# EAGLE design untitled (EAGLE 9.6.0)
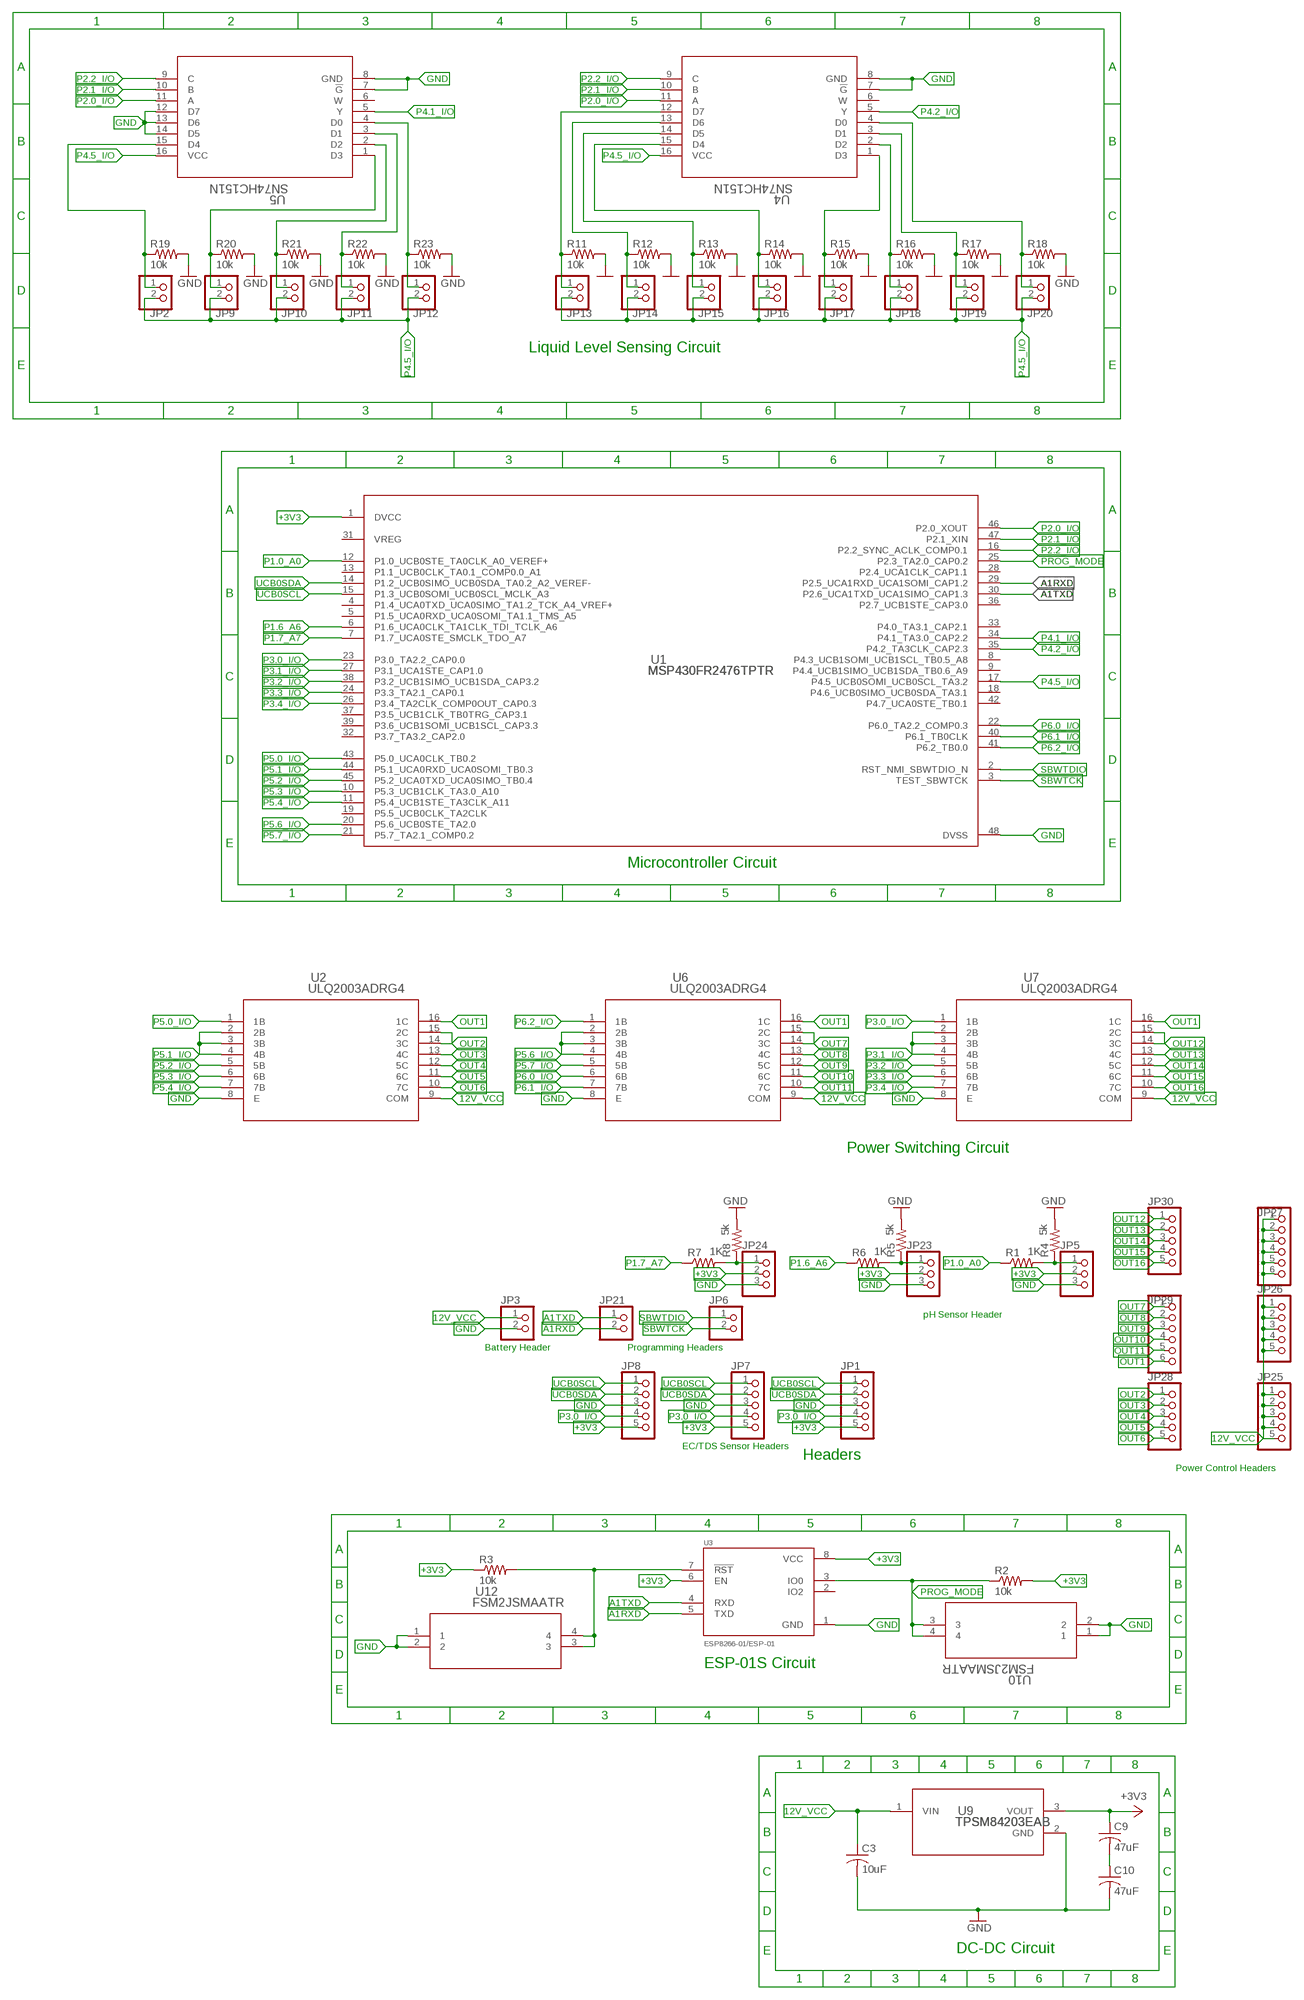
[diagram p0: schematic, sheet 1]

## Parts
C3  10uF  C-USC1206  [C1206]
C9  47uF  C-USC1206  [C1206]
C10  47uF  C-USC1206  [C1206]
JP1  PINHD-1X5  [1X05]
JP2  PINHD-1X2  [1X02]
JP3  PINHD-1X2  [1X02]
JP5  PINHD-1X3  [1X03]
JP6  PINHD-1X2  [1X02]
JP7  PINHD-1X5  [1X05]
JP8  PINHD-1X5  [1X05]
JP9  PINHD-1X2  [1X02]
JP10  PINHD-1X2  [1X02]
JP11  PINHD-1X2  [1X02]
JP12  PINHD-1X2  [1X02]
JP13  PINHD-1X2  [1X02]
JP14  PINHD-1X2  [1X02]
JP15  PINHD-1X2  [1X02]
JP16  PINHD-1X2  [1X02]
JP17  PINHD-1X2  [1X02]
JP18  PINHD-1X2  [1X02]
JP19  PINHD-1X2  [1X02]
JP20  PINHD-1X2  [1X02]
JP21  PINHD-1X2  [1X02]
JP23  PINHD-1X3  [1X03]
JP24  PINHD-1X3  [1X03]
JP25  PINHD-1X5  [1X05]
JP26  PINHD-1X5  [1X05]
JP27  PINHD-1X6  [1X06]
JP28  PINHD-1X5  [1X05]
JP29  PINHD-1X6  [1X06]
JP30  PINHD-1X5  [1X05]
R1  1K  R-US_R1206  [R1206]
R2  10k  R-US_R1206  [R1206]
R3  10k  R-US_R1206  [R1206]
R4  5k  R-US_R1206  [R1206]
R5  5k  R-US_R1206  [R1206]
R6  1K  R-US_R1206  [R1206]
R7  1K  R-US_R1206  [R1206]
R8  5k  R-US_R1206  [R1206]
R11  10k  R-US_R1206  [R1206]
R12  10k  R-US_R1206  [R1206]
R13  10k  R-US_R1206  [R1206]
R14  10k  R-US_R1206  [R1206]
R15  10k  R-US_R1206  [R1206]
R16  10k  R-US_R1206  [R1206]
R17  10k  R-US_R1206  [R1206]
R18  10k  R-US_R1206  [R1206]
R19  10k  R-US_R1206  [R1206]
R20  10k  R-US_R1206  [R1206]
R21  10k  R-US_R1206  [R1206]
R22  10k  R-US_R1206  [R1206]
R23  10k  R-US_R1206  [R1206]
U1  MSP430FR2476TPTR  [PT0048A_N]
U2  ULQ2003ADRG4  [D16]
U3  ESP8266-01/ESP-01  [XCVR_ESP8266-01/ESP-01]
U4  SN74HC151N  [N16]
U5  SN74HC151N  [N16]
U6  ULQ2003ADRG4  [D16]
U7  ULQ2003ADRG4  [D16]
U9  TPSM84203EAB  [EAB0003A]
U10  FSM2JSMAATR  [SWITCH_FSM2JSMAA_TYC]
U12  FSM2JSMAATR  [SWITCH_FSM2JSMAA_TYC]

## Nets
12V_VCC: C3.1 JP3.1 JP25.1 JP25.2 JP25.3 JP25.4 JP25.5 JP26.1 JP26.2 JP26.3 JP26.4 JP26.5 JP27.1 JP27.2 JP27.3 JP27.4 JP27.5 JP27.6 U2.9(COM) U6.9(COM) U7.9(COM) U9.1(VIN)
+3V3: C9.1 JP1.5 JP5.2 JP7.5 JP8.5 JP23.2 JP24.2 R2.2 R3.1 U1.1(DVCC) U3.6(EN) U3.8(VCC) U9.3(VOUT)
A1RXD: JP21.2 U1.29(P2.5_UCA1RXD_UCA1SOMI_CAP1.2) U3.5(TXD)
A1TXD: JP21.1 U1.30(P2.6_UCA1TXD_UCA1SIMO_CAP1.3) U3.4(RXD)
GND: C3.2 C10.2 JP1.3 JP3.2 JP5.3 JP7.3 JP8.3 JP23.3 JP24.3 R4.2 R5.2 R8.2 R11.2 R12.2 R13.2 R14.2 R15.2 R16.2 R17.2 R18.2 R19.2 R20.2 R21.2 R22.2 R23.2 U1.48(DVSS) U2.8(E) U3.1(GND) U4.7(!G) U4.8(GND) U5.7(!G) U5.8(GND) U5.12(D7) U5.13(D6) U5.14(D5) U6.8(E) U7.8(E) U9.2(GND) U10.1 U10.2 U12.1 U12.2
N$1: R3.2 U3.7(!RST) U12.3 U12.4
N$2: JP18.1 R16.1 U4.2(D2)
N$3: JP19.1 R17.1 U4.3(D1)
N$4: JP13.1 R11.1 U4.12(D7)
N$5: C9.2 C10.1
N$6: JP14.1 R12.1 U4.13(D6)
N$7: JP15.1 R13.1 U4.14(D5)
N$8: JP16.1 R14.1 U4.15(D4)
N$9: JP5.1 R1.2 R4.1
N$10: JP23.1 R5.1 R6.2
N$11: JP24.1 R7.2 R8.1
N$13: JP20.1 R18.1 U4.4(D0)
N$14: JP2.1 R19.1 U5.15(D4)
N$15: JP12.1 R23.1 U5.4(D0)
N$16: JP9.1 R20.1 U5.1(D3)
N$17: JP10.1 R21.1 U5.2(D2)
N$18: JP11.1 R22.1 U5.3(D1)
N$63: JP17.1 R15.1 U4.1(D3)
OUT1: JP29.6 U2.16(1C) U6.16(1C) U7.16(1C)
OUT2: JP28.1 U2.14(3C) U2.15(2C)
OUT3: JP28.2 U2.13(4C)
OUT4: JP28.3 U2.12(5C)
OUT5: JP28.4 U2.11(6C)
OUT6: JP28.5 U2.10(7C)
OUT7: JP29.1 U6.14(3C) U6.15(2C)
OUT8: JP29.2 U6.13(4C)
OUT9: JP29.3 U6.12(5C)
OUT10: JP29.4 U6.11(6C)
OUT11: JP29.5 U6.10(7C)
OUT12: JP30.1 U7.14(3C) U7.15(2C)
OUT13: JP30.2 U7.13(4C)
OUT14: JP30.3 U7.12(5C)
OUT15: JP30.4 U7.11(6C)
OUT16: JP30.5 U7.10(7C)
P1.0_A0: R1.1 U1.12(P1.0_UCB0STE_TA0CLK_A0_VEREF+)
P1.6_A6: R6.1 U1.6(P1.6_UCA0CLK_TA1CLK_TDI_TCLK_A6)
P1.7_A7: R7.1 U1.7(P1.7_UCA0STE_SMCLK_TDO_A7)
P2.0_I/O: U1.46(P2.0_XOUT) U4.11(A) U5.11(A)
P2.1_I/O: U1.47(P2.1_XIN) U4.10(B) U5.10(B)
P2.2_I/O: U1.16(P2.2_SYNC_ACLK_COMP0.1) U4.9(C) U5.9(C)
P3.0_I/O: JP1.4 JP7.4 JP8.4 U1.23(P3.0_TA2.2_CAP0.0) U7.1(1B)
P3.1_I/O: U1.27(P3.1_UCA1STE_CAP1.0) U7.2(2B) U7.3(3B) U7.4(4B)
P3.2_I/O: U1.38(P3.2_UCB1SIMO_UCB1SDA_CAP3.2) U7.5(5B)
P3.3_I/O: U1.24(P3.3_TA2.1_CAP0.1) U7.6(6B)
P3.4_I/O: U1.26(P3.4_TA2CLK_COMP0OUT_CAP0.3) U7.7(7B)
P4.1_I/O: U1.34(P4.1_TA3.0_CAP2.2) U5.5(Y)
P4.2_I/O: U1.35(P4.2_TA3CLK_CAP2.3) U4.5(Y)
P4.5_I/O: JP2.2 JP9.2 JP10.2 JP11.2 JP12.2 JP13.2 JP14.2 JP15.2 JP16.2 JP17.2 JP18.2 JP19.2 JP20.2 U1.17(P4.5_UCB0SOMI_UCB0SCL_TA3.2) U4.16(VCC) U5.16(VCC)
P5.0_I/O: U1.43(P5.0_UCA0CLK_TB0.2) U2.1(1B)
P5.1_I/O: U1.44(P5.1_UCA0RXD_UCA0SOMI_TB0.3) U2.2(2B) U2.3(3B) U2.4(4B)
P5.2_I/O: U1.45(P5.2_UCA0TXD_UCA0SIMO_TB0.4) U2.5(5B)
P5.3_I/O: U1.10(P5.3_UCB1CLK_TA3.0_A10) U2.6(6B)
P5.4_I/O: U1.11(P5.4_UCB1STE_TA3CLK_A11) U2.7(7B)
P5.6_I/O: U1.20(P5.6_UCB0STE_TA2.0) U6.2(2B) U6.3(3B) U6.4(4B)
P5.7_I/O: U1.21(P5.7_TA2.1_COMP0.2) U6.5(5B)
P6.0_I/O: U1.22(P6.0_TA2.2_COMP0.3) U6.6(6B)
P6.1_I/O: U1.40(P6.1_TB0CLK) U6.7(7B)
P6.2_I/O: U1.41(P6.2_TB0.0) U6.1(1B)
PROG_MODE: R2.1 U1.25(P2.3_TA2.0_CAP0.2) U3.3(IO0) U10.3 U10.4
SBWTCK: JP6.2 U1.3(TEST_SBWTCK)
SBWTDIO: JP6.1 U1.2(RST_NMI_SBWTDIO_N)
UCB0SCL: JP1.1 JP7.1 JP8.1 U1.15(P1.3_UCB0SOMI_UCB0SCL_MCLK_A3)
UCB0SDA: JP1.2 JP7.2 JP8.2 U1.14(P1.2_UCB0SIMO_UCB0SDA_TA0.2_A2_VEREF-)
Unconnected: U1.4(P1.4_UCA0TXD_UCA0SIMO_TA1.2_TCK_A4_VREF+) U1.5(P1.5_UCA0RXD_UCA0SOMI_TA1.1_TMS_A5) U1.8(P4.3_UCB1SOMI_UCB1SCL_TB0.5_A8) U1.9(P4.4_UCB1SIMO_UCB1SDA_TB0.6_A9) U1.13(P1.1_UCB0CLK_TA0.1_COMP0.0_A1) U1.18(P4.6_UCB0SIMO_UCB0SDA_TA3.1) U1.19(P5.5_UCB0CLK_TA2CLK) U1.28(P2.4_UCA1CLK_CAP1.1) U1.31(VREG) U1.32(P3.7_TA3.2_CAP2.0) U1.33(P4.0_TA3.1_CAP2.1) U1.36(P2.7_UCB1STE_CAP3.0) U1.37(P3.5_UCB1CLK_TB0TRG_CAP3.1) U1.39(P3.6_UCB1SOMI_UCB1SCL_CAP3.3) U1.42(P4.7_UCA0STE_TB0.1) U3.2(IO2) U4.6(W) U5.6(W)

## Notes on the sheet
- Liquid Level Sensing Circuit
- Microcontroller Circuit
- Power Switching Circuit
- pH Sensor Header
- Battery Header | Programming Headers
- EC/TDS Sensor Headers
- Headers
- Power Control Headers
- ESP-01S Circuit
- DC-DC Circuit

## Library data of the parts
C3 C9 C10 = rcl:C-US: CAPACITOR, American symbol; SPICEPREFIX: C
JP1 JP7 JP8 JP25 JP26 JP28 JP30 = pinhead:PINHD-1X5: PIN HEADER
JP2 JP3 JP6 JP9-JP21 = pinhead:PINHD-1X2: PIN HEADER
JP5 JP23 JP24 = pinhead:PINHD-1X3: PIN HEADER
JP27 JP29 = pinhead:PINHD-1X6: PIN HEADER
R1-R8 R11-R23 = rcl:R-US_: RESISTOR, American symbol; SPICEPREFIX: R
U1 = MSP430FR2476TPTR:MSP430FR2476TPTR; COPYRIGHT: Copyright (C) 2023 Ultra Librarian. All rights reserved.; MANUFACTURER_PART_NUMBER: MSP430FR2476TPTR; MFR_NAME: Texas Instruments; REFDES: RefDes; TYPE: TYPE
U2 = SD1 Control System:ULQ2003ADRG4; COPYRIGHT: Copyright (C) 2023 Ultra Librarian. All rights reserved.; MANUFACTURER_PART_NUMBER: ULQ2003ADRG4; MFR_NAME: Texas Instruments
U3 = ESP8266-01_ESP-01:ESP8266-01/ESP-01: MakerFocus 4pcs ESP8266 ESP-01 Serial Wireless WiFi Transceiver Receiver Module 1MB SPI Flash DC3.0-3.6V Internet of Things WiFi Module Board Compatible with Ar duino Check availability <https://pricing.snapeda.com/parts/ESP8266-01/ESP-01/AI-Thinker/view-part?ref=eda>; AVAILABILITY: Not in stock; DESCRIPTION: MakerFocus 4pcs ESP8266 ESP-01 Serial Wireless WiFi Transceiver Receiver Module 1MB SPI Flash DC3.0-3.6V Internet of Things WiFi Module Board Compatible with Ar duino; MF: AI-Thinker; MP: ESP8266-01/ESP-01; PACKAGE: Non-Standard AI-Thinker; PRICE: None
U4 U5 = Multiplexers:SN74HC151N; COPYRIGHT: Copyright (C) 2022 Ultra Librarian. All rights reserved.; MANUFACTURER_PART_NUMBER: SN74HC151N; MFR_NAME: Texas Instruments
U6 U7 = SD1 Control System:ULQ2003ADRG4; COPYRIGHT: Copyright (C) 2023 Ultra Librarian. All rights reserved.; MANUFACTURER_PART_NUMBER: ULQ2003ADRG4; MFR_NAME: Texas Instruments; SPICEPREFIX: X
U9 = 3.3V Supply New:TPSM84203EAB; COPYRIGHT: Copyright (C) 2023 Ultra Librarian. All rights reserved.; MANUFACTURER_PART_NUMBER: TPSM84203EAB; MFR_NAME: Texas Instruments; REFDES: RefDes; TYPE: TYPE
U10 U12 = ESP8266-01_ESP-01:FSM2JSMAATR; COPYRIGHT: Copyright (C) 2023 Ultra Librarian. All rights reserved.; MANUFACTURER_PART_NUMBER: FSM2JSMAATR; MFR_NAME: TE Connectivity

## Board
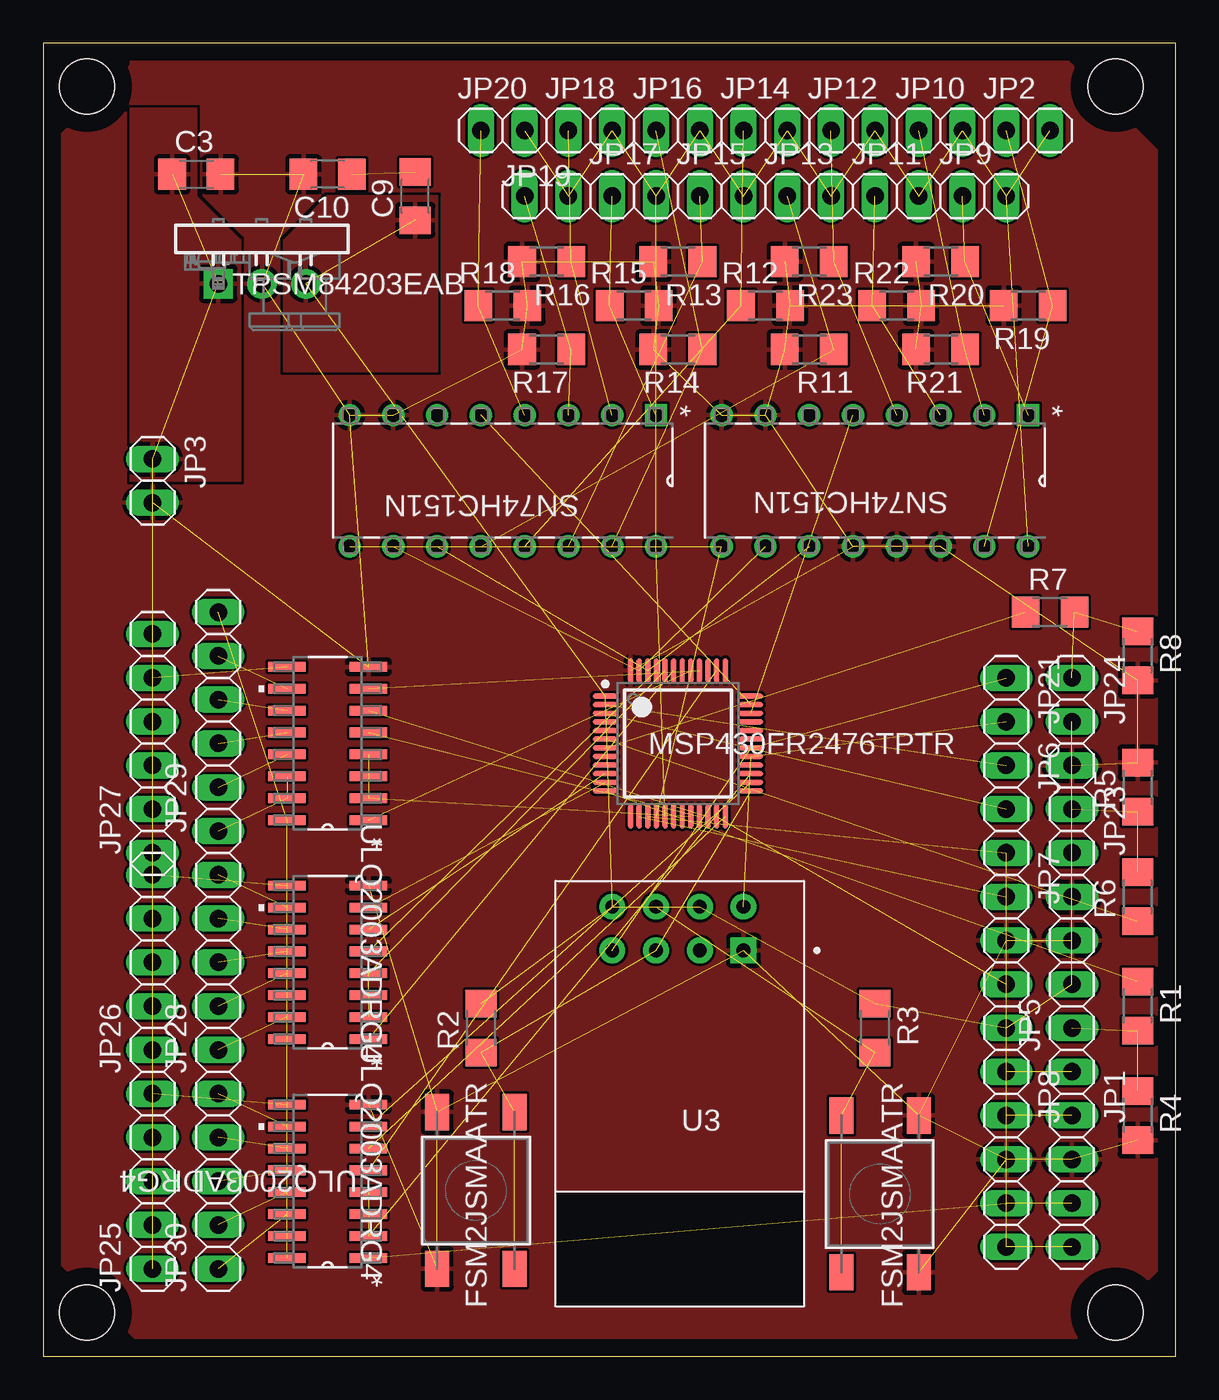
[diagram p1: board, top side]
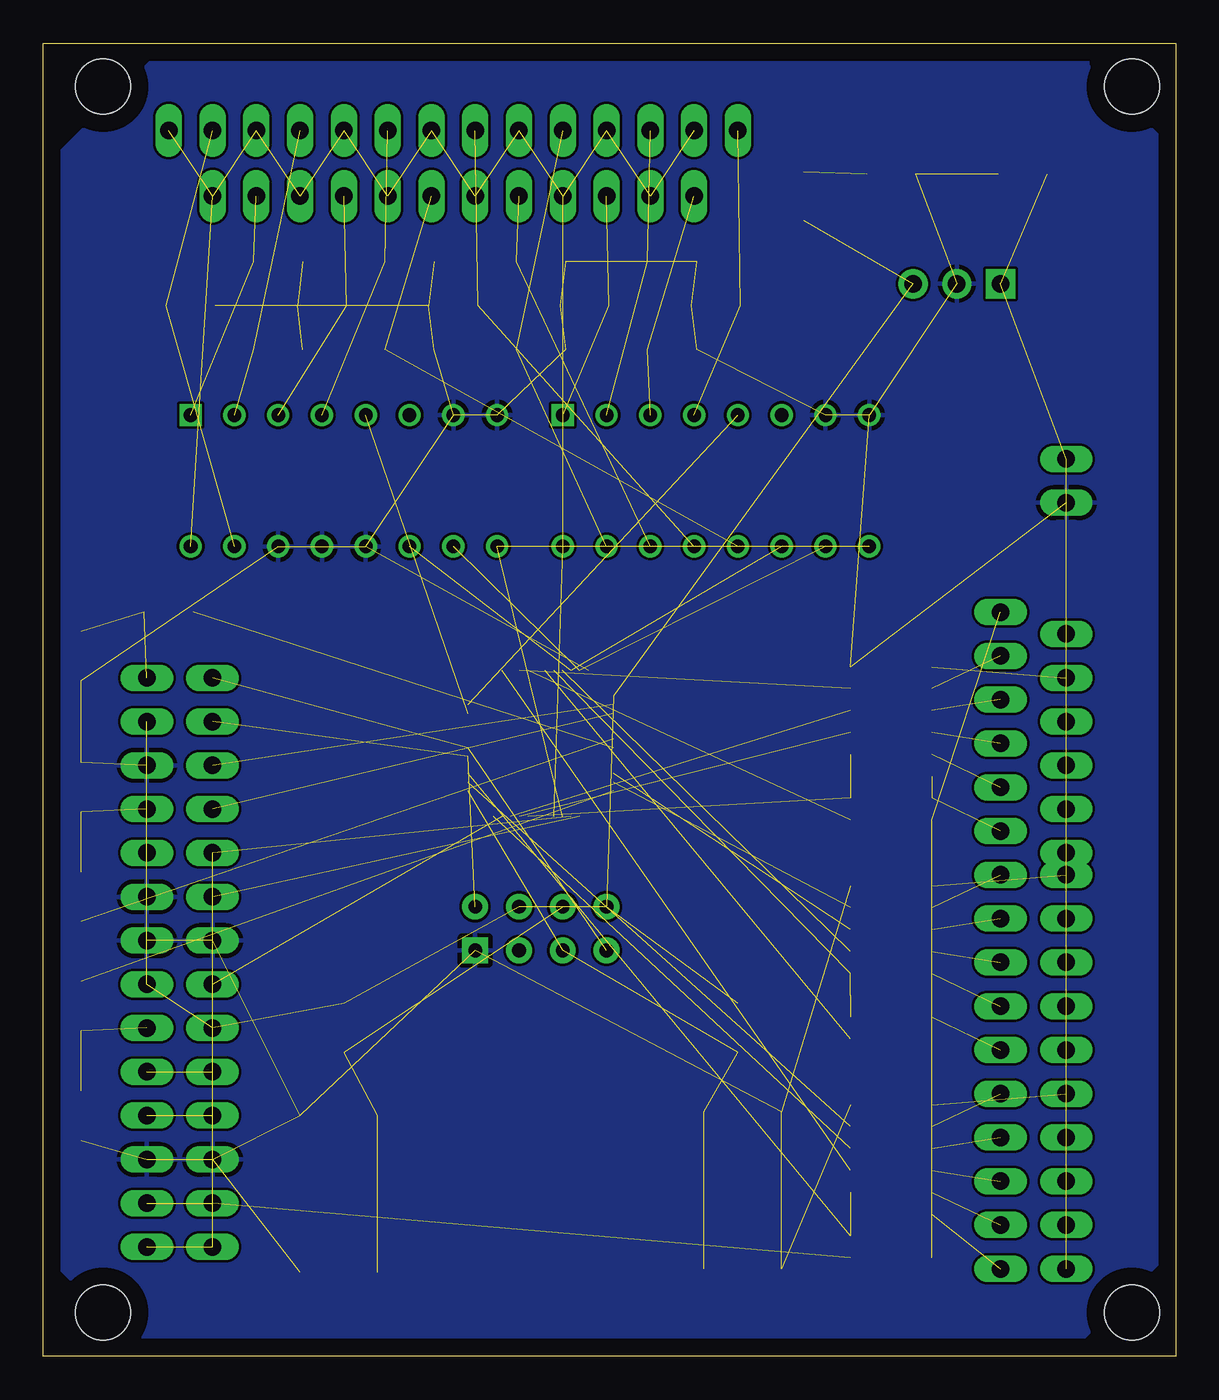
[diagram p2: board, bottom side, seen from below]

Size 65.71 x 76.19 mm. Coordinates in mm from the lower left corner, seen from the top.
Outline: 0,0 65.71,0 65.71,76.19 0,76.19 0,0
Copper layers (1*16): Top 0.035mm / dielectric 1.5mm / Bottom 0.035mm
Design rules "default *": minimum track width 6mil, minimum drill 0.35mm, track to track 6mil, track to pad 6mil, pad to pad 6mil, via to via 6mil, smd to smd 6mil, copper to edge 40mil, drill to drill 6mil, minimum pad ring 10mil, minimum via ring 8mil, stop-mask expansion 4mil, vias tented up to drill 0mil, thermal gap 10mil
Holes 3.17 mm at 2.54,73.66 62.23,73.66 62.23,2.54 2.54,2.54

### Footprints (pad centres in the part's own frame; a part is rotated, then mirrored left to right if it is on the bottom)
C1206 = smd 1.6 x 1.8: 1 -1.4,0; 2 1.4,0
1X05 = drill 1.016 long: 1 -5.08,0; 2 -2.54,0; 3 0,0; 4 2.54,0; 5 5.08,0
1X02 = drill 1.016 long: 1 -1.27,0; 2 1.27,0
1X03 = drill 1.016 long: 1 -2.54,0; 2 0,0; 3 2.54,0
1X06 = drill 1.016 long: 1 -6.35,0; 2 -3.81,0; 3 -1.27,0; 4 1.27,0; 5 3.81,0; 6 6.35,0
R1206 = smd 1.6 x 1.803: 1 -1.422,0; 2 1.422,0
PT0048A_N = smd 1.45 x 0.3: 1 -4.225,2.75; 2 -4.225,2.25; 3 -4.225,1.75; 4 -4.225,1.25; 5 -4.225,0.75; 6 -4.225,0.25; 7 -4.225,-0.25; 8 -4.225,-0.75; 9 -4.225,-1.25; 10 -4.225,-1.75; 11 -4.225,-2.25; 12 -4.225,-2.75; 25 4.225,-2.75; 26 4.225,-2.25; 27 4.225,-1.75; 28 4.225,-1.25; 29 4.225,-0.75; 30 4.225,-0.25; 31 4.225,0.25; 32 4.225,0.75; 33 4.225,1.25; 34 4.225,1.75; 35 4.225,2.25; 36 4.225,2.75 | smd 0.3 x 1.45: 13 -2.75,-4.225; 14 -2.25,-4.225; 15 -1.75,-4.225; 16 -1.25,-4.225; 17 -0.75,-4.225; 18 -0.25,-4.225; 19 0.25,-4.225; 20 0.75,-4.225; 21 1.25,-4.225; 22 1.75,-4.225; 23 2.25,-4.225; 24 2.75,-4.225; 37 2.75,4.225; 38 2.25,4.225; 39 1.75,4.225; 40 1.25,4.225; 41 0.75,4.225; 42 0.25,4.225; 43 -0.25,4.225; 44 -0.75,4.225; 45 -1.25,4.225; 46 -1.75,4.225; 47 -2.25,4.225; 48 -2.75,4.225
D16 = smd 2.184 x 0.559: 1 -2.362,4.445; 2 -2.362,3.175; 3 -2.362,1.905; 4 -2.362,0.635; 5 -2.362,-0.635; 6 -2.362,-1.905; 7 -2.362,-3.175; 8 -2.362,-4.445; 9 2.362,-4.445; 10 2.362,-3.175; 11 2.362,-1.905; 12 2.362,-0.635; 13 2.362,0.635; 14 2.362,1.905; 15 2.362,3.175; 16 2.362,4.445
XCVR_ESP8266-01/ESP-01 = drill 0.8 pad 1.5 square: 1 -3.81,-8.31 | drill 0.8 pad 1.5: 2 -1.27,-8.31; 3 1.27,-8.31; 4 3.81,-8.31; 5 -3.81,-10.85; 6 -1.27,-10.85; 7 1.27,-10.85; 8 3.81,-10.85
N16 = drill 0.787 pad 1.295 square: 1 -7.62,17.78 | drill 0.787 pad 1.295: 2 -7.62,15.24; 3 -7.62,12.7; 4 -7.62,10.16; 5 -7.62,7.62; 6 -7.62,5.08; 7 -7.62,2.54; 8 -7.62,0; 9 0,0; 10 0,2.54; 11 0,5.08; 12 0,7.62; 13 0,10.16; 14 0,12.7; 15 0,15.24; 16 0,17.78
EAB0003A = drill 1.016 pad 1.702 square: 1 -2.54,0 | drill 1.016 pad 1.702: 2 0,0; 3 2.54,0
SWITCH_FSM2JSMAA_TYC = smd 2.108 x 1.397: 1 0,0; 2 9.093,0; 3 0,-4.496; 4 9.093,-4.496

### Placement (x,y rotation side)
C3  8.89,68.58 0 top
C9  21.59,67.31 90 top
C10  16.51,68.58 180 top
JP1  59.69,11.43 270 top
JP2  57.15,71.12 0 top
JP3  6.35,50.8 270 top
JP5  59.69,21.59 90 top
JP6  55.88,33.02 270 top
JP7  55.88,24.13 270 top
JP8  55.88,11.43 270 top
JP9  54.61,67.31 0 top
JP10  52.07,71.12 0 top
JP11  49.53,67.31 0 top
JP12  46.99,71.12 0 top
JP13  44.45,67.31 0 top
JP14  41.91,71.12 0 top
JP15  39.37,67.31 0 top
JP16  36.83,71.12 0 top
JP17  34.29,67.31 0 top
JP18  31.75,71.12 0 top
JP19  29.21,67.31 0 top
JP20  26.67,71.12 0 top
JP21  55.88,38.1 270 top
JP23  59.69,29.21 270 top
JP24  59.69,36.83 270 top
JP25  6.35,10.16 90 top
JP26  6.35,22.86 90 top
JP27  6.35,35.56 90 top
JP28  10.16,22.86 90 top
JP29  10.16,36.83 90 top
JP30  10.16,10.16 90 top
R1  63.5,20.32 270 top
R2  25.4,19.05 90 top
R3  48.26,19.05 270 top
R4  63.5,13.97 270 top
R5  63.5,33.02 90 top
R6  63.5,26.67 90 top
R7  58.42,43.18 0 top
R8  63.5,40.64 270 top
R11  44.45,58.42 180 top
R12  41.91,60.96 0 top
R13  36.83,63.5 180 top
R14  36.83,58.42 180 top
R15  34.29,60.96 0 top
R16  29.21,63.5 180 top
R17  29.21,58.42 180 top
R18  26.67,60.96 0 top
R19  57.15,60.96 180 top
R20  52.07,63.5 180 top
R21  52.07,58.42 180 top
R22  49.53,60.96 0 top
R23  44.45,63.5 180 top
U1  36.83,35.56 0 top
U2  16.51,22.86 180 top
U3  36.83,15.24 180 top
U4  17.78,46.99 270 top
U5  39.37,46.99 270 top
U6  16.51,35.56 180 top
U7  16.51,10.16 180 top
U9  12.7,62.23 0 top
U10  22.86,5.08 90 top
U12  50.8,13.97 270 top

### Tracks (layer width: path | path; a pad name or v marks a point on that pad's centre or on a via)
12V_VCC  (21 unrouted)
  pour Top (isolate 0): 11.43,50.8 11.43,64.77 8.89,67.31 8.89,72.39 5.08,72.39 5.08,50.8
+3V3  (12 unrouted)
  pour Top (isolate 0): 22.86,67.31 16.51,67.31 13.97,64.77 13.97,57.15 22.86,57.15
A1RXD  (2 unrouted)
A1TXD  (2 unrouted)
GND  (41 unrouted)
  pour Top (isolate 0, rank 2): 0,69.85 5.08,74.93 5.08,76.2 58.42,76.2 59.69,74.93 66.04,68.58 66.04,67.31 66.04,6.35 64.77,5.08 59.69,0 58.42,0 6.35,0 0,6.35
  pour Bottom (isolate 0, rank 2): 0,69.85 5.08,74.93 5.08,76.2 58.42,76.2 66.04,68.58 66.04,6.35 59.69,0 6.35,0 0,6.35
N$1  (3 unrouted)
N$2  (2 unrouted)
N$3  (2 unrouted)
N$4  (2 unrouted)
N$5  (1 unrouted)
N$6  (2 unrouted)
N$7  (2 unrouted)
N$8  (2 unrouted)
N$9  (2 unrouted)
N$10  (2 unrouted)
N$11  (2 unrouted)
N$13  (2 unrouted)
N$14  (2 unrouted)
N$15  (2 unrouted)
N$16  (2 unrouted)
N$17  (2 unrouted)
N$18  (2 unrouted)
N$63  (2 unrouted)
OUT1  (3 unrouted)
OUT2  (2 unrouted)
OUT3  (1 unrouted)
OUT4  (1 unrouted)
OUT5  (1 unrouted)
OUT6  (1 unrouted)
OUT7  (2 unrouted)
OUT8  (1 unrouted)
OUT9  (1 unrouted)
OUT10  (1 unrouted)
OUT11  (1 unrouted)
OUT12  (2 unrouted)
OUT13  (1 unrouted)
OUT14  (1 unrouted)
OUT15  (1 unrouted)
OUT16  (1 unrouted)
P1.0_A0  (1 unrouted)
P1.6_A6  (1 unrouted)
P1.7_A7  (1 unrouted)
P2.0_I/O  (2 unrouted)
P2.1_I/O  (2 unrouted)
P2.2_I/O  (2 unrouted)
P3.0_I/O  (4 unrouted)
P3.1_I/O  (3 unrouted)
P3.2_I/O  (1 unrouted)
P3.3_I/O  (1 unrouted)
P3.4_I/O  (1 unrouted)
P4.1_I/O  (1 unrouted)
P4.2_I/O  (1 unrouted)
P4.5_I/O  (15 unrouted)
P5.0_I/O  (1 unrouted)
P5.1_I/O  (3 unrouted)
P5.2_I/O  (1 unrouted)
P5.3_I/O  (1 unrouted)
P5.4_I/O  (1 unrouted)
P5.6_I/O  (3 unrouted)
P5.7_I/O  (1 unrouted)
P6.0_I/O  (1 unrouted)
P6.1_I/O  (1 unrouted)
P6.2_I/O  (1 unrouted)
PROG_MODE  (4 unrouted)
SBWTCK  (1 unrouted)
SBWTDIO  (1 unrouted)
UCB0SCL  (3 unrouted)
UCB0SDA  (3 unrouted)